# EAGLE design justregulator (EAGLE 8.3.1)
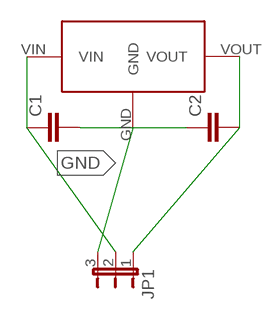
[diagram p0: schematic, sheet 1]

## Parts
C1  C-EUC0603  [C0603]
C2  C-EUC0603  [C0603]
JP1  JP2E  [JP2]
U$1  HT7333  [SOT89]

## Nets
GND: C1.2 C2.1 JP1.3 U$1.GND
N$1: C1.1 JP1.2 U$1.VIN
N$3: C2.2 JP1.1 U$1.VOUT

## Library data of the parts
C1 C2 = rcl:C-EU: CAPACITOR, European symbol
JP1 = jumper:JP2E: JUMPER
U$1 = HT7333_SOT89:HT7333

## Board
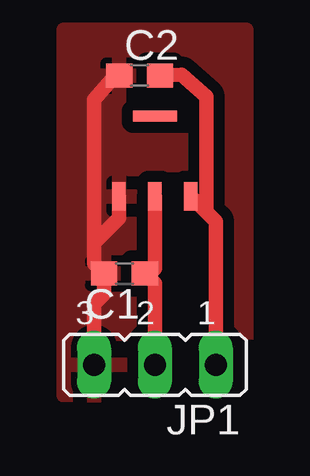
[diagram p1: board, top side]

No outline drawn. Coordinates in mm, seen from the top.
Copper layers (1*16): Top 0.035mm / dielectric 1.5mm / Bottom 0.035mm
Design rules "default *": minimum track width 6mil, minimum drill 0.35mm, track to track 18mil, track to pad 18mil, pad to pad 18mil, via to via 18mil, smd to smd 18mil, copper to edge 40mil, drill to drill 6mil, minimum pad ring 10mil, minimum via ring 8mil, stop-mask expansion 4mil, vias tented up to drill 0mil, thermal gap 10mil

### Footprints (pad centres in the part's own frame; a part is rotated, then mirrored left to right if it is on the bottom)
C0603 = smd 1.1 x 1: 1 -0.85,0; 2 0.85,0
JP2 = drill 0.914 long: 1 -2.54,0; 2 0,0; 3 2.54,0
SOT89 = smd 0.559 x 1.194: GND -1.499,-0.597; VIN 0,-0.597; VOUT 1.499,-0.597 | smd 1.829 x 0.457: P$4 0,2.743

### Placement (x,y rotation side)
C1  16.51,5.08 180 top
C2  17.14,13.34 0 top
JP1  17.78,1.27 180 top
U$1  17.78,8.89 0 top

### Tracks (layer width: path | path; a pad name or v marks a point on that pad's centre or on a via)
GND
  Top 0.61: U$1.GND 16.28,7.39 15.24,6.35 | 15.24,6.35 15.24,5.5 C1.2 15.66,4.23 15.24,3.81 JP1.3 | C2.1 16.13,13.34 15.24,12.32 15.24,6.35
  pour Top: 13.97,0 21.59,0 21.59,15.24 13.97,15.24
N$1
  Top 0.61: JP1.2 17.78,4.66 17.46,4.97 | 17.46,4.97 C1.1 | U$1.VIN 17.78,5.29 17.46,4.97
N$3
  Top 0.61: JP1.1 20.32,7.25 19.94,7.63 | 19.94,7.63 U$1.VOUT | C2.2 18.88,13.37 19.94,12.45 19.94,7.63